# EAGLE design MacroStepper_v2.0 (EAGLE 9.5.2)
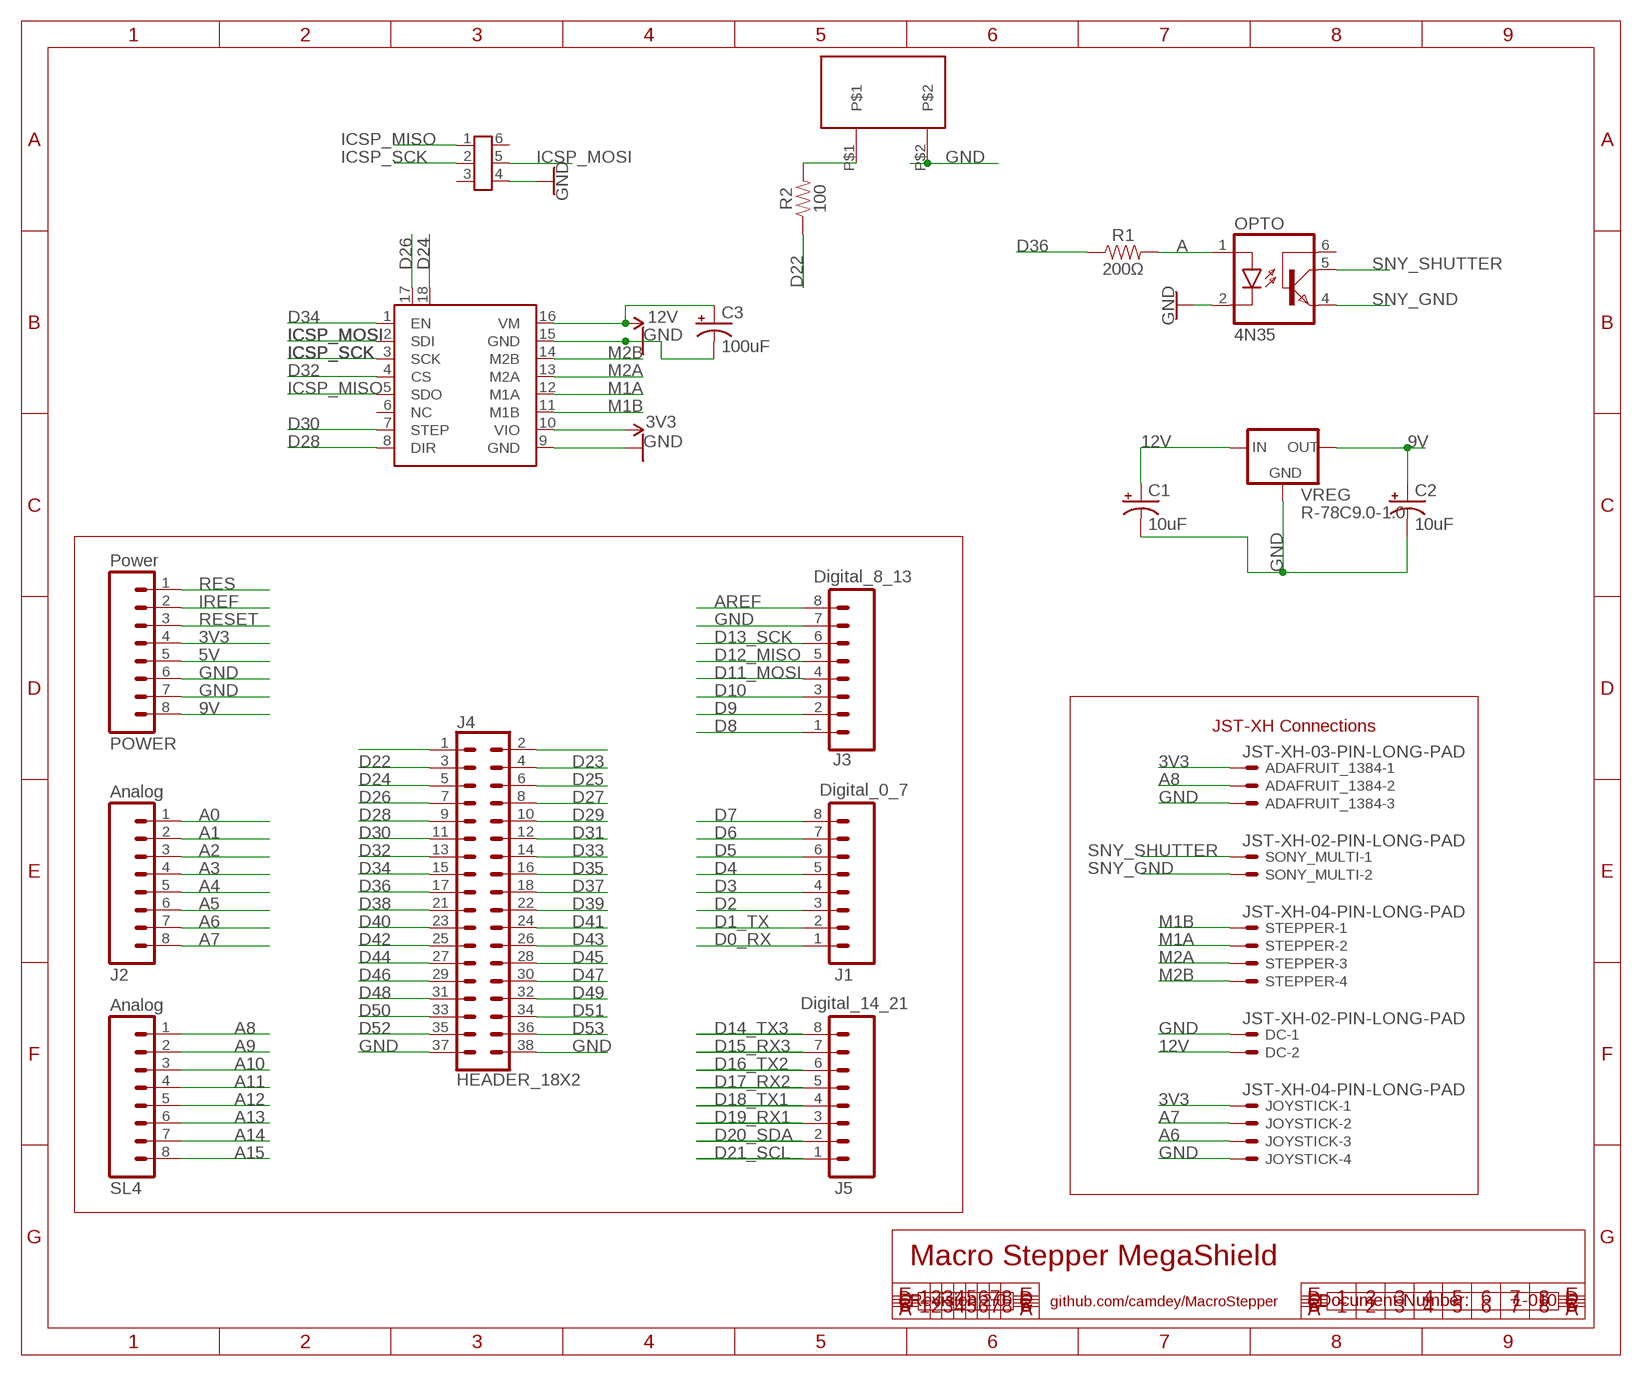
[diagram p0: schematic, sheet 1]

## Parts
ADAFRUIT_1384  JST-XH-03-PIN-LONG-PAD  [JST-XH-03-PACKAGE-LONG-PAD]
C1  10uF  10UF-POLAR-RADIAL-2.5MM-25V-20%  [CPOL-RADIAL-2.5MM-5MM]
C2  10uF  10UF-POLAR-RADIAL-2.5MM-25V-20%  [CPOL-RADIAL-2.5MM-5MM]
C3  100uF  100UF-POLAR-RADIAL-2.5MM-25V-20%  [CPOL-RADIAL-2.5MM-6.5MM]
DC  JST-XH-02-PIN-LONG-PAD  [JST-XH-02-PACKAGE-LONG-PAD]
ICSP  MEGA_ICSP  [MEGA_ICSP]
J1  Digital_0_7  M08  [1X08]
J2  Analog  M08  [1X08]
J3  Digital_8_13  M08  [1X08]
J4  HEADER_18X2  [2X18]
J5  Digital_14_21  M08  [1X08]
JOYSTICK  JST-XH-04-PIN-LONG-PAD  [JST-XH-04-PACKAGE-LONG-PAD]
OPTO  4N35  [DIL06]
PIEZO  PS1240P02BT  [PS1240P02BT]
POWER  Power  M08  [1X08]
R1  200Ω  RESISTORAXIAL-0.3  [AXIAL-0.3]
R2  100  100OHM-HORIZ-1/4W-1%  [AXIAL-0.3]
SL4  Analog  M08  [1X08]
SONY_MULTI  JST-XH-02-PIN-LONG-PAD  [JST-XH-02-PACKAGE-LONG-PAD]
STEPPER  JST-XH-04-PIN-LONG-PAD  [JST-XH-04-PACKAGE-LONG-PAD]
TMC2130  TMC2130  [DIL16]
VREG  R-78C9.0-1.0  [SIP3]

## Nets
3V3: ADAFRUIT_1384.1 JOYSTICK.1 POWER.4 TMC2130.10(VIO)
5V: POWER.5
9V: C2.1(+) POWER.8 VREG.3(OUT)
12V: C1.1(+) C3.1(+) DC.2 TMC2130.16(VM) VREG.1(IN)
A: OPTO.1(A) R1.P$2
A0: J2.1
A1: J2.2
A2: J2.3
A3: J2.4
A4: J2.5
A5: J2.6
A6: J2.7 JOYSTICK.3
A7: J2.8 JOYSTICK.2
A8: ADAFRUIT_1384.2 SL4.1
A9: SL4.2
A10: SL4.3
A11: SL4.4
A12: SL4.5
A13: SL4.6
A14: SL4.7
A15: SL4.8
AREF: J3.8
D0_RX: J1.1
D1_TX: J1.2
D2: J1.3
D3: J1.4
D4: J1.5
D5: J1.6
D6: J1.7
D7: J1.8
D8: J3.1
D9: J3.2
D10: J3.3
D11_MOSI: J3.4
D12_MISO: J3.5
D13_SCK: J3.6
D14_TX3: J5.8
D15_RX3: J5.7
D16_TX2: J5.6
D17_RX2: J5.5
D18_TX1: J5.4
D19_RX1: J5.3
D20_SDA: J5.2
D21_SCL: J5.1
D22: J4.3(D22) R2.P$1
D23: J4.4(D23)
D24: J4.5(D24) TMC2130.18(DIAG1)
D25: J4.6(D25)
D26: J4.7(D26) TMC2130.17(DIAG0)
D27: J4.8(D27)
D28: J4.9(D28) TMC2130.8(DIR)
D29: J4.10(D29)
D30: J4.11(D30) TMC2130.7(STEP)
D31: J4.12(D31)
D32: J4.13(D32) TMC2130.4(CS)
D33: J4.14(D33)
D34: J4.15(D34) TMC2130.1(EN)
D35: J4.16(D35)
D36: J4.17(D36) R1.P$1
D37: J4.18(D37)
D38: J4.21(D38)
D39: J4.22(D39)
D40: J4.23(D40)
D41: J4.24(D41)
D42: J4.25(D42)
D43: J4.26(D43)
D44: J4.27(D44)
D45: J4.28(D45)
D46: J4.29(D46)
D47: J4.30(D47)
D48: J4.31(D48)
D49: J4.32(D49)
D50: J4.33(D50)
D51: J4.34(D51)
D52: J4.35(D52)
D53: J4.36(D53)
GND: ADAFRUIT_1384.3 C1.2(-) C2.2(-) C3.2(-) DC.1 ICSP.4(GND) J3.7 J4.37(GND) J4.38(GND) JOYSTICK.4 OPTO.2(C) PIEZO.P$2 POWER.6 POWER.7 TMC2130.9(GND) TMC2130.15(GND) VREG.2(GND)
ICSP_MISO: ICSP.1(MISO) TMC2130.5(SDO)
ICSP_MOSI: ICSP.5(MOSI) TMC2130.2(SDI)
ICSP_SCK: ICSP.2(SCK) TMC2130.3(SCK)
IREF: POWER.2
M1A: STEPPER.2 TMC2130.12(M1A)
M1B: STEPPER.1 TMC2130.11(M1B)
M2A: STEPPER.3 TMC2130.13(M2A)
M2B: STEPPER.4 TMC2130.14(M2B)
N$1: J4.1(5V)
N$2: J4.2(5V)
N$3: PIEZO.P$1 R2.P$2
RES: POWER.1
RESET: POWER.3
SNY_GND: OPTO.4(EMI) SONY_MULTI.2
SNY_SHUTTER: OPTO.5(COL) SONY_MULTI.1
Unconnected: ICSP.3(RST) ICSP.6(5V) OPTO.6(BAS) TMC2130.6(NC)

## Notes on the sheet
- JST-XH Connections
- Macro Stepper MegaShield
- Revision 2.0 | github.com/camdey/MacroStepper | Document Number: | 1-010

## Library data of the parts
ADAFRUIT_1384 = JST XH Connectors v1-0:JST-XH-03-PIN: JST XH Connector 2 Pin Wire to board connector. Pitch: 2,54 mm, (0.100") Number of pins: 3 Created by Rembrandt Electronics www.rembrandtelectronics.com
C1 C2 = SparkFun-Capacitors:10UF-POLAR: 10.0µF polarized capacitors A capacitor is a passive two-terminal electrical component used to store electrical energy temporarily in an electric field.; PROD_ID: CAP-08440
C3 = SparkFun-Capacitors:100UF-POLAR: 100µF polarized capacitors A capacitor is a passive two-terminal electrical component used to store electrical energy temporarily in an electric field.; PROD_ID: CAP-08439
DC SONY_MULTI = JST XH Connectors v1-0:JST-XH-02-PIN: JST XH Connector 2 Pin Wire to board connector. Pitch: 2,54 mm, (0.100") Number of pins: 2 Created by Rembrandt Electronics www.rembrandtelectronics.com
ICSP = my_library:MEGA_ICSP
J1-J3 J5 POWER SL4 = SparkFun:M08: Header 8 Standard 8-pin 0.1" header. Use with straight break away headers (SKU : PRT-00116), right angle break away headers (PRT-00553), swiss pins (PRT-00743), machine pins (PRT-00117), and female headers (PRT-00115).
J4 = my_library:HEADER_18X2: Multi connection point. Often used as Generic Header-pin footprint for 0.1 inch spaced/style header connections On any of the 0.1 inch spaced packages, you can populate with these: Break Away Headers - Straight <https://www.sparkfun.com/products/116> (PRT-00116) Break Away Male Headers - Right Angle <https://www.sparkfun.com/products/553> (PRT-00553) Female Headers <https://www.sparkfun.com/products/115> (PRT-00115) Break Away Headers - Machine Pin <https://www.sparkfun.com/products/117> (PRT-00117) Break Away Female Headers - Swiss Machine Pin <https://www.sparkfun.com/products/743> (PRT-00743)
JOYSTICK STEPPER = JST XH Connectors v1-0:JST-XH-04-PIN: JST XH Connector 2 Pin Wire to board connector. Pitch: 2,54 mm, (0.100") Number of pins: 4 Created by Rembrandt Electronics www.rembrandtelectronics.com
OPTO = optocoupler:4N35: MOTOROLA OPTO COUPLER; MF: FAIRCHILD SEMICONDUCTOR; MPN: 4N35; OC_FARNELL: 1328375; OC_NEWARK: 72K9946
PIEZO = PS1240P02BT:PS1240P02BT; AVAILABILITY: Unavailable; DESCRIPTION: Buzzers Transducer, Externally Driven Piezo 3V 4kHz 60dB @ 3V, 10cm Through Hole PC Pins; MF: TDK; MP: PS1240P02BT; PACKAGE: 2020 TDK; PRICE: None
R1 = SparkFun-Resistors:RESISTOR: Generic Resistor Package
R2 = SparkFun-Resistors:100OHM: 100Ω resistor A resistor is a passive two-terminal electrical component that implements electrical resistance as a circuit element. Resistors act to reduce current flow, and, at the same time, act to lower voltage levels within circuits. - Wikipedia; PROD_ID: RES-12181
TMC2130 = my_library:TMC2130: Pololu stepper driver based on the A4983.
VREG = r-78xx_10:R-78C*-1.0: Innoline R-78Cxx-1.0 Series Switching Regulators - 1.0A, Wide Input Range, High Efficiency Source: http://www.recom-international.com/pdf/Innoline/R-78Cxx-1.0.pdf; MF: Recom; MPN: R-78C9.0-1.0; OC_FARNELL: 1903041; OC_NEWARK: 62X9497

## Board
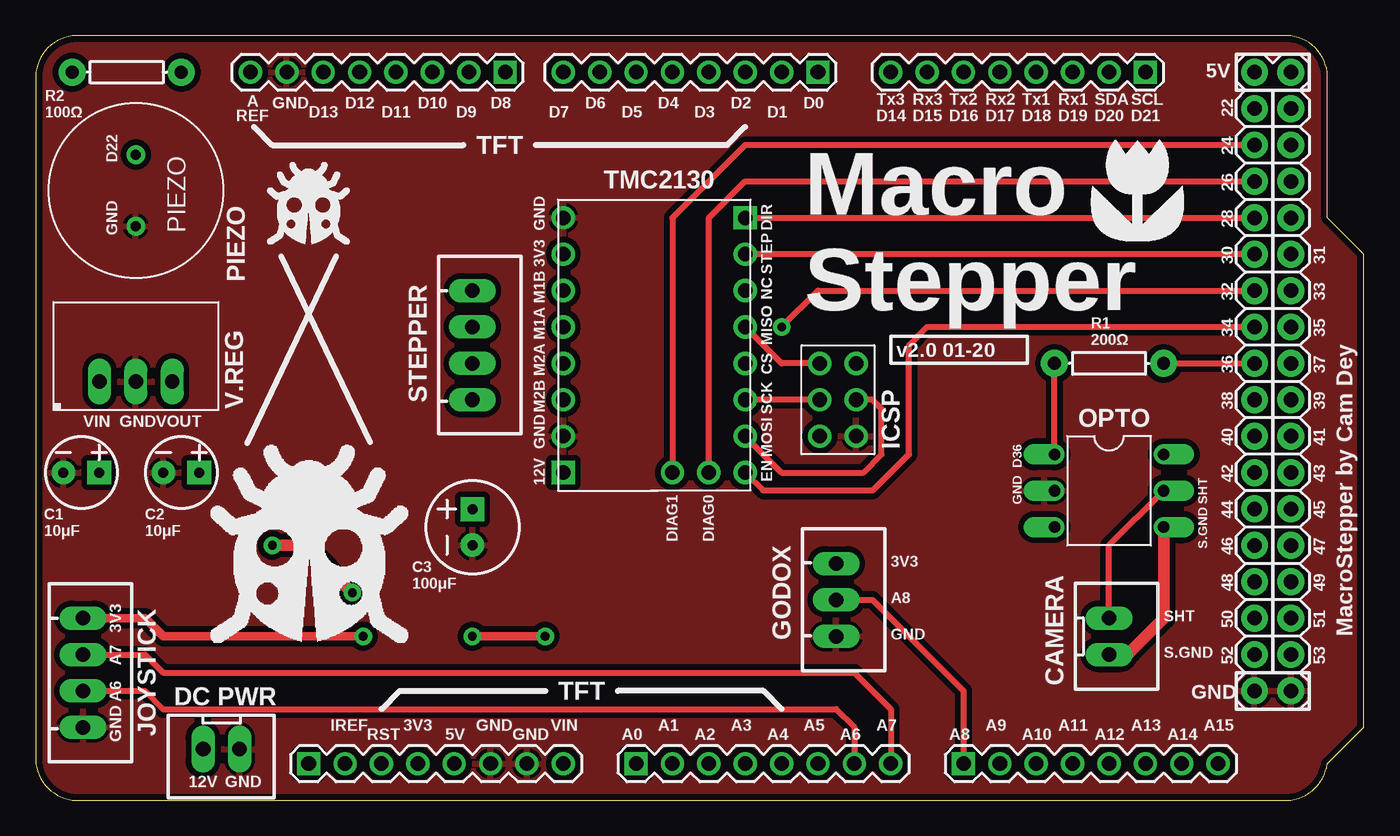
[diagram p1: board, top side]
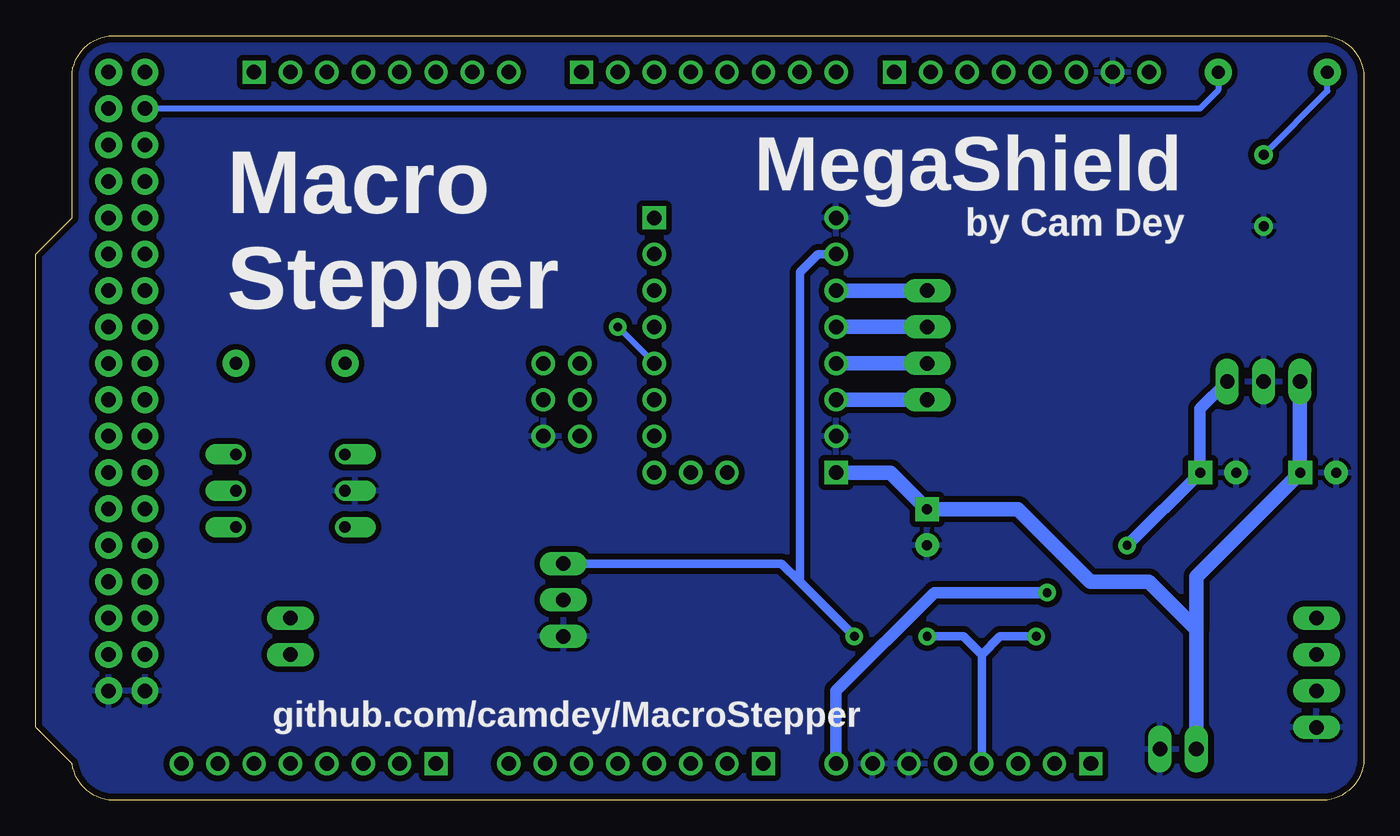
[diagram p2: board, bottom side, seen from below]

Size 92.71 x 53.34 mm. Coordinates in mm from the lower left corner, seen from the top.
Outline: 0,2.54 arc74 2.54,0 87.63,0 arc74 90.17,2.54 92.71,5.08 92.71,38.1 90.17,40.64 90.17,50.8 arc74 87.63,53.34 2.54,53.34 arc74 0,50.8 0,2.54
Copper layers (1*16): Top 0.035mm / dielectric 1.5mm / Bottom 0.035mm
Design rules "default *": minimum track width 10mil, minimum drill 24mil, track to track 16mil, track to pad 16mil, pad to pad 16mil, via to via 16mil, smd to smd 8mil, copper to edge 18mil, drill to drill 8mil, minimum pad ring 12mil, minimum via ring 12mil, stop-mask expansion 4mil, vias tented up to drill 0mil, thermal gap 10mil

### Footprints (pad centres in the part's own frame; a part is rotated, then mirrored left to right if it is on the bottom)
JST-XH-03-PACKAGE-LONG-PAD = drill 1.016 long: 1 -2.54,0; 2 0,0; 3 2.54,0
CPOL-RADIAL-2.5MM-5MM = drill 0.7 pad 1.651 square: 1 1.25,0 | drill 0.7 pad 1.651: 2 -1.25,0
CPOL-RADIAL-2.5MM-6.5MM = drill 0.7 pad 1.651 square: 1 1.25,0 | drill 0.7 pad 1.651: 2 -1.25,0
JST-XH-02-PACKAGE-LONG-PAD = drill 1.016 long: 1 -1.27,0; 2 1.27,0
MEGA_ICSP = drill 1.016: 1 -1.27,2.54; 2 -1.27,0; 3 -1.27,-2.54; 4 1.27,-2.54; 5 1.27,0; 6 1.27,2.54
1X08 = drill 1.016 square: 1 0,0 | drill 1.016: 2 2.54,0; 3 5.08,0; 4 7.62,0; 5 10.16,0; 6 12.7,0; 7 15.24,0; 8 17.78,0
2X18 = drill 1.016 pad 1.88: 1 0,0; 2 0,2.54; 3 2.54,0; 4 2.54,2.54; 5 5.08,0; 6 5.08,2.54; 7 7.62,0; 8 7.62,2.54; 9 10.16,0; 10 10.16,2.54; 11 12.7,0; 12 12.7,2.54; 13 15.24,0; 14 15.24,2.54; 15 17.78,0; 16 17.78,2.54; 17 20.32,0; 18 20.32,2.54; 21 22.86,0; 22 22.86,2.54; 23 25.4,0; 24 25.4,2.54; 25 27.94,0; 26 27.94,2.54; 27 30.48,0; 28 30.48,2.54; 29 33.02,0; 30 33.02,2.54; 31 35.56,0; 32 35.56,2.54; 33 38.1,0; 34 38.1,2.54; 35 40.64,0; 36 40.64,2.54; 37 43.18,0; 38 43.18,2.54
JST-XH-04-PACKAGE-LONG-PAD = drill 1.016 long: 1 -3.81,0; 2 -1.27,0; 3 1.27,0; 4 3.81,0
DIL06 = drill 0.813 offset: 1 -2.54,-3.81; 2 0,-3.81; 3 2.54,-3.81; 4 2.54,3.81; 5 0,3.81; 6 -2.54,3.81
PS1240P02BT = drill 0.7: P$1 -2.5,0; P$2 2.5,0
AXIAL-0.3 = drill 0.9 pad 1.88: P$1 -3.81,0; P$2 3.81,0
DIL16 = drill 1.016: 1 -6.35,8.89; 2 -6.35,6.35; 3 -6.35,3.81; 4 -6.35,1.27; 5 -6.35,-1.27; 6 -6.35,-3.81; 7 -6.35,-6.35; 9 6.35,-8.89; 10 6.35,-6.35; 11 6.35,-3.81; 12 6.35,-1.27; 13 6.35,1.27; 14 6.35,3.81; 15 6.35,6.35; 17 -3.81,8.89; 18 -1.27,8.89 | drill 1.016 square: 8 -6.35,-8.89; 16 6.35,8.89
SIP3 = drill 1 long: 1 -2.54,0; 2 0,0; 3 2.54,0

### Placement (x,y rotation side)
ADAFRUIT_1384  55.88,13.97 270 top
C1  3.17,22.86 0 top
C2  10.16,22.86 0 top
C3  30.48,19.05 90 top
DC  12.95,3.56 180 top
ICSP  56.01,27.94 0 top
J1  54.61,50.8 180 top
J2  41.91,2.54 0 top
J3  32.77,50.8 180 top
J4  85.09,50.8 270 top
J5  77.47,50.8 180 top
JOYSTICK  3.3,8.89 270 top
OPTO  74.93,21.59 270 top
PIEZO  6.99,42.55 270 top
POWER  19.05,2.54 0 top
R1  74.93,30.48 180 top
R2  6.35,50.8 180 top
SL4  64.77,2.54 0 top
SONY_MULTI  74.93,11.43 270 top
STEPPER  30.48,31.75 270 top
TMC2130  43.18,31.75 180 top
VREG  6.99,29.21 0 top

### Tracks (layer width: path | path; a pad name or v marks a point on that pad's centre or on a via)
3V3  (via drill 0.61)
  Top 0.61: v35.56,11.43 v30.48,11.43 | JOYSTICK.1 7.62,12.7 8.89,11.43 v22.86,11.43
  Bottom 0.61: TMC2130.10 38.1,38.1 39.37,36.83 39.37,15.24 | v35.56,11.43 39.37,15.24 | v30.48,11.43 27.94,11.43 26.67,10.16 | 26.67,10.16 25.4,11.43 v22.86,11.43 | POWER.4 26.67,10.16 | 39.37,15.24 40.64,16.51 ADAFRUIT_1384.1
9V  (via drill 0.61)
  Top 0.813: v16.51,17.78 18.8,17.78 v22.1,14.48
  Bottom 0.813: POWER.8 36.83,7.62 29.97,14.48 v22.1,14.48 | VREG.3 11.43,27.3 11.43,22.88 C2.1 16.49,17.78 v16.51,17.78
12V
  Bottom 1.016: TMC2130.16 33.04,22.86 C3.1 24.13,20.3 19.07,15.24 14.99,15.24 11.68,11.94 | VREG.1 4.45,22.88 C1.1 11.68,15.6 11.68,11.94 | DC.2 11.68,11.94
A
  Top 0.406: OPTO.1 R1.P$2
A6
  Top 0.406: J2.7 57.15,5.08 55.88,6.35 8.89,6.35 7.62,7.62 JOYSTICK.3
A7
  Top 0.406: JOYSTICK.2 7.62,10.16 8.89,8.89 57.15,8.89 59.69,6.35 J2.8
A8
  Top 0.406: ADAFRUIT_1384.2 58.42,13.97 64.77,7.62 SL4.1
D22
  Bottom 0.406: J4.3 13.97,48.26 13.34,48.26 11.43,48.26 10.16,49.53 R2.P$1
D24
  Top 0.406: TMC2130.18 44.45,40.64 49.53,45.72 J4.5
D26
  Top 0.406: TMC2130.17 46.99,40.64 49.53,43.18 J4.7
D28
  Top 0.406: TMC2130.8 J4.9
D30
  Top 0.406: J4.11 TMC2130.7
D32  (via drill 0.61)
  Top 0.406: v52.07,33.02 54.61,35.56 J4.13
  Bottom 0.406: TMC2130.4 v52.07,33.02
D34
  Top 0.406: TMC2130.1 50.8,21.59 58.42,21.59 60.96,24.13 60.96,31.75 62.23,33.02 J4.15
D36
  Top 0.406: R1.P$1 J4.17
GND
  pour Bottom (isolate 0.406): 0,50.8 arc-74 2.54,53.34 87.63,53.34 arc-74 90.17,50.8 90.17,40.64 92.71,38.1 92.71,5.08 90.17,2.54 arc-74 87.63,0 2.54,0 arc-90 0,2.54
  pour Top (isolate 0.406): 0,50.8 arc-74 2.54,53.34 87.63,53.34 arc-74 90.17,50.8 90.17,40.64 92.71,38.1 92.71,5.08 90.17,2.54 arc-74 87.63,0 2.54,0 arc-74 0,2.54
ICSP_MISO
  Top 0.406: ICSP.1 52.07,30.48 TMC2130.5
ICSP_MOSI
  Top 0.406: TMC2130.2 52.07,22.86 57.78,22.86 59.05,24.13 59.05,27.3 58.42,27.94 ICSP.5
ICSP_SCK
  Top 0.406: ICSP.2 TMC2130.3
M1A
  Bottom 1.016: TMC2130.12 STEPPER.2
M1B
  Bottom 1.016: STEPPER.1 TMC2130.11
M2A
  Bottom 1.016: STEPPER.3 TMC2130.13
M2B
  Bottom 1.016: TMC2130.14 STEPPER.4
N$3
  Bottom 0.406: PIEZO.P$1 2.54,49.49 R2.P$2
SNY_GND
  Top 0.813: SONY_MULTI.2 76.2,10.16 78.74,12.7 OPTO.4
SNY_SHUTTER
  Top 0.406: SONY_MULTI.1 74.93,17.78 OPTO.5

### Text on the board
tPlace: 5V | Tx3 | Rx3 | Tx2 | Rx2 | Tx1 | Rx1 | SDA | SCL | 22 | R2 / 100Ω | A | GND | D13 | D12 | D11 | D10 | D9 | D8 | D7 | D6 | D5 | D4 | D3 | D2 | D1 | D0 | REF | D14 | D15 | D16 | D17 | D18 | D19 | D20 | D21 | D22 | TFT | 24 | TMC2130 | 26 | GND | DIR | 28 | GND | 3V3 | STEP | 30 | 31 | PIEZO | M1B | NC | 32 | 33 | Macro / Stepper | M1A | MISO | R1 / 200Ω | 34 | 35 | v2.0 01-20 | M2A | CS | 36 | 37 | STEPPER | V.REG | M2B | SCK | 38 | 39 | VIN | GND | VOUT | OPTO | GND | ICSP | 40 | 41 | MOSI | D36 | 12V | EN | 42 | 43 | GND | SHT | 44 | 45 | C1 / 10μF | C2 / 10μF | DIAG1 | DIAG0 | S.GND | 46 | 47 | 3V3 | C3 / 100μF | 48 | 49 | A8 | 3V3 | SHT | 50 | 51 | GODOX | GND | MacroStepper by Cam Dey | S.GND | A7 | 52 | 53 | CAMERA | A6 | DC PWR | TFT | GND | IREF | 3V3 | GND | VIN | A1 | A3 | A5 | A7 | A9 | A11 | A13 | A15 | GND | JOYSTICK | RST | 5V | GND | A0 | A2 | A4 | A6 | A8 | A10 | A12 | A14 | 12V | GND
bPlace: MegaShield | by Cam Dey | Macro / Stepper | github.com/camdey/MacroStepper